# Altium schematic sheet SuperBot_Sheet_main.SchDoc
size A4
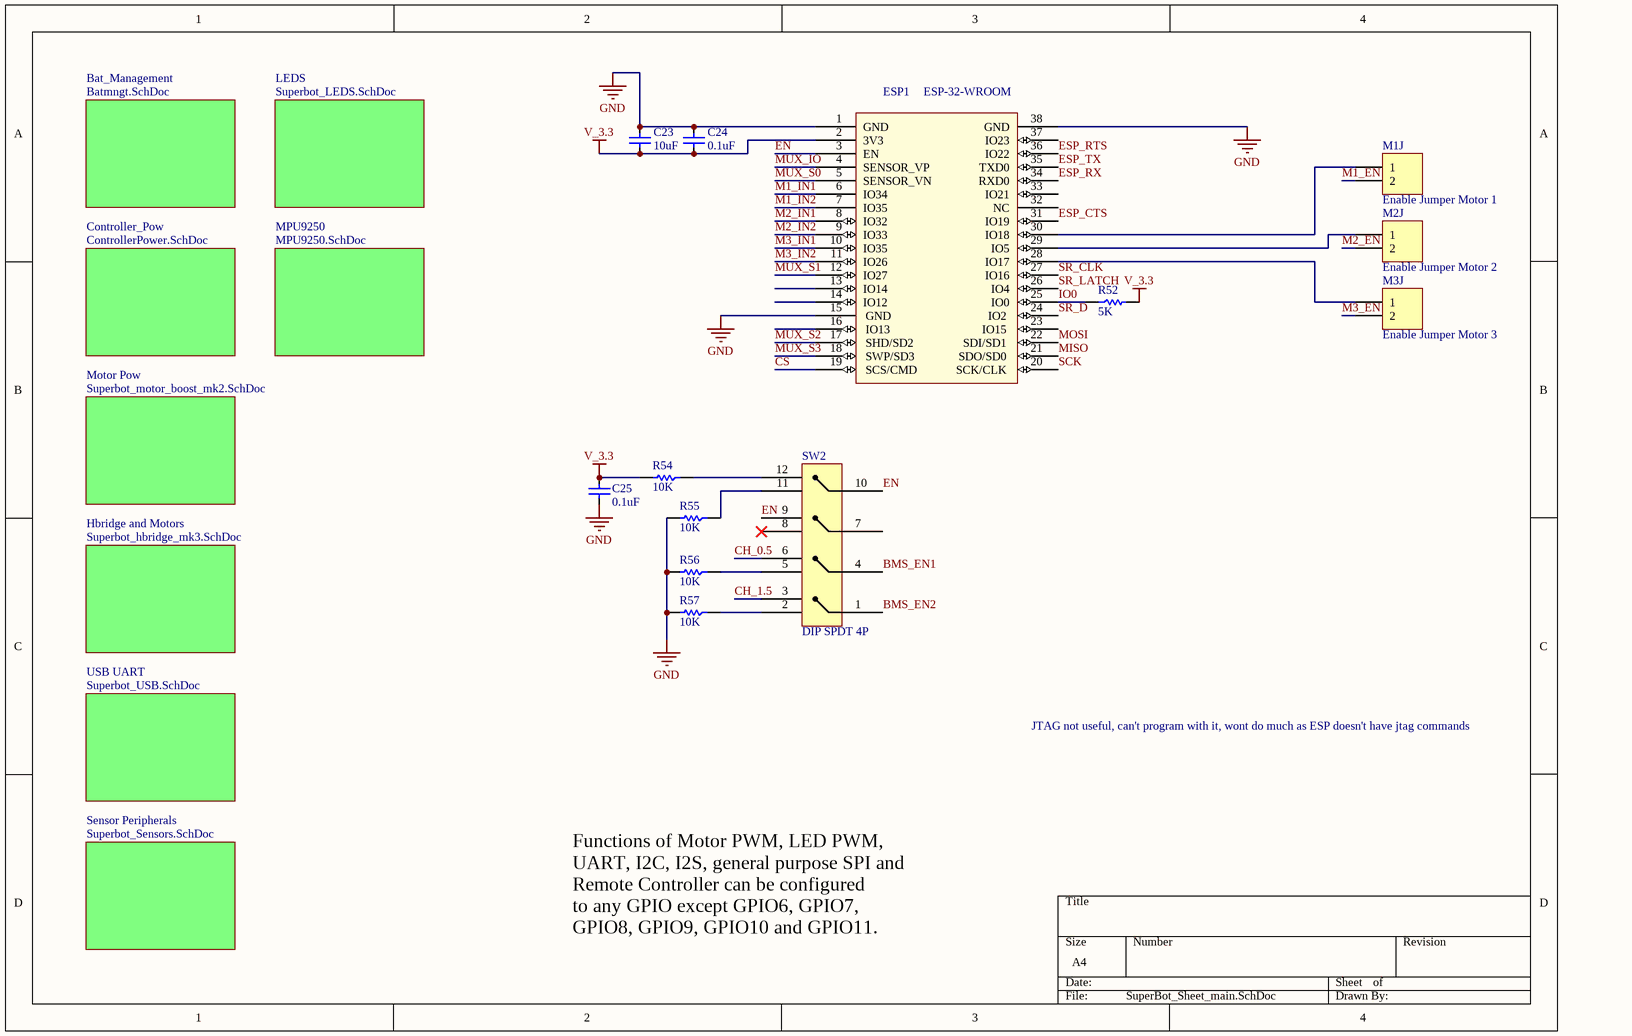
[diagram p0: SuperBot_Sheet_main.SchDoc]

## Parts
C23  10uF  [CAP0603R]
C24  0.1uF  [CAP0603R]
C25  0.1uF  [CAP0603R]
ESP1  ESP-32-WROOM  [ESP-32-WROOM]
M1J  Enable Jumper Motor 1  [HDR1X2]
M2J  Enable Jumper Motor 2  [HDR1X2]
M3J  Enable Jumper Motor 3  [HDR1X2]
R52  5K  [RES0603R]
R54  10K  [RES0603R]
R55  10K  [RES0603R]
R56  10K  [RES0603R]
R57  10K  [RES0603R]
SW2  DIP SPDT 4P  [DIP SPDT 4P]

## Sub-sheets
Bat_Management = Batmngt.SchDoc: no entries
Controller_Pow = ControllerPower.SchDoc: no entries
Hbridge and Motors = Superbot_hbridge_mk3.SchDoc: no entries
LEDS = Superbot_LEDS.SchDoc: no entries
Motor Pow = Superbot_motor_boost_mk2.SchDoc: no entries
MPU9250 = MPU9250.SchDoc: no entries
Sensor Peripherals = Superbot_Sensors.SchDoc: no entries
USB UART = Superbot_USB.SchDoc: no entries

## Nets
GND: C23.1 C24.1 C25.2 ESP1.1(GND) ESP1.15(GND) ESP1.38(GND) R55.2 R56.2 R57.2
V_3.3: C23.2 C24.2 C25.1 ESP1.2(3V3) R52.2 R54.2
BMS_EN1: SW2.4
BMS_EN2: SW2.1
CH_0.5: SW2.6
CH_1.5: SW2.3
CS: ESP1.19(SCS/CMD)
EN: ESP1.3(EN) SW2.9 SW2.10
ESP_CTS: ESP1.31(IO19)
ESP_RTS: ESP1.36(IO22)
ESP_RX: ESP1.34(RXD0)
ESP_TX: ESP1.35(TXD0)
IO0: ESP1.25(IO0) R52.1
M1_EN: M1J.2
M1_IN1: ESP1.6(IO34)
M1_IN2: ESP1.7(IO35)
M2_EN: M2J.2
M2_IN1: ESP1.8(IO32)
M2_IN2: ESP1.9(IO33)
M3_EN: M3J.2
M3_IN1: ESP1.10(IO35)
M3_IN2: ESP1.11(IO26)
MISO: ESP1.21(SDO/SD0)
MOSI: ESP1.22(SDI/SD1)
MUX_IO: ESP1.4(SENSOR_VP)
MUX_S0: ESP1.5(SENSOR_VN)
MUX_S1: ESP1.12(IO27)
MUX_S2: ESP1.17(SHD/SD2)
MUX_S3: ESP1.18(SWP/SD3)
SCK: ESP1.20(SCK/CLK)
SR_CLK: ESP1.27(IO16)
SR_D: ESP1.24(IO2)
SR_LATCH: ESP1.26(IO4)
NetESP1_28: ESP1.28(IO17) M3J.1
NetESP1_29: ESP1.29(IO5) M2J.1
NetESP1_30: ESP1.30(IO18) M1J.1
NetR54_1: R54.1 SW2.12
NetR55_1: R55.1 SW2.11
NetR56_1: R56.1 SW2.5
NetR57_1: R57.1 SW2.2

Not connected (* = marked no-connect by the designer): ESP1 13(IO14) 14(IO12) 16(IO13) 23(IO15) 32(NC) 33(IO21) 37(IO23); SW2 7 8*

## Notes on the sheet
- JTAG not useful, can't program with it, wont do much as ESP doesn't have jtag commands
- Functions of Motor PWM, LED PWM, UART, I2C, I2S, general purpose SPI and Remote Controller can be configured
  to any GPIO except GPIO6, GPIO7, GPIO8, GPIO9, GPIO10 and GPIO11.

## Library data of the parts
C23-C25 = C: Capacitor; Manufacturer: Microchip Technology; Manufacturer Part Num: MIC5378YC5-TR; Class I: Passive; Revision: July-2002: Re-released for DXP Platform.; Supplier 1: Digikey; Supplier Part Number 1: *; Supplier Part Number 1: 1611-MIC5378YC5-CT-ND
  C23: Value: 10uF
  C24 C25: Value: 0.1uF
ESP1 = ESP-32-WROOM: ESP-32-WROOM, WIFI + BT
M1J M2J M3J = Header 2: Header, 2-Pin; LatestRevisionDate: 17-Jul-2002; LatestRevisionNote: Re-released for DXP Platform.; Publisher: Altium Limited
R52 R54-R57 = R: Resistor; Supplier 1: Digikey; Supplier Part Number 1: *
  R52: Value: 5K
  R54-R57: Value: 10K